# Altium schematic sheet 03_ZYNQ_Power.SchDoc
size A2; SheetNumber: 3; SheetTotal: 9
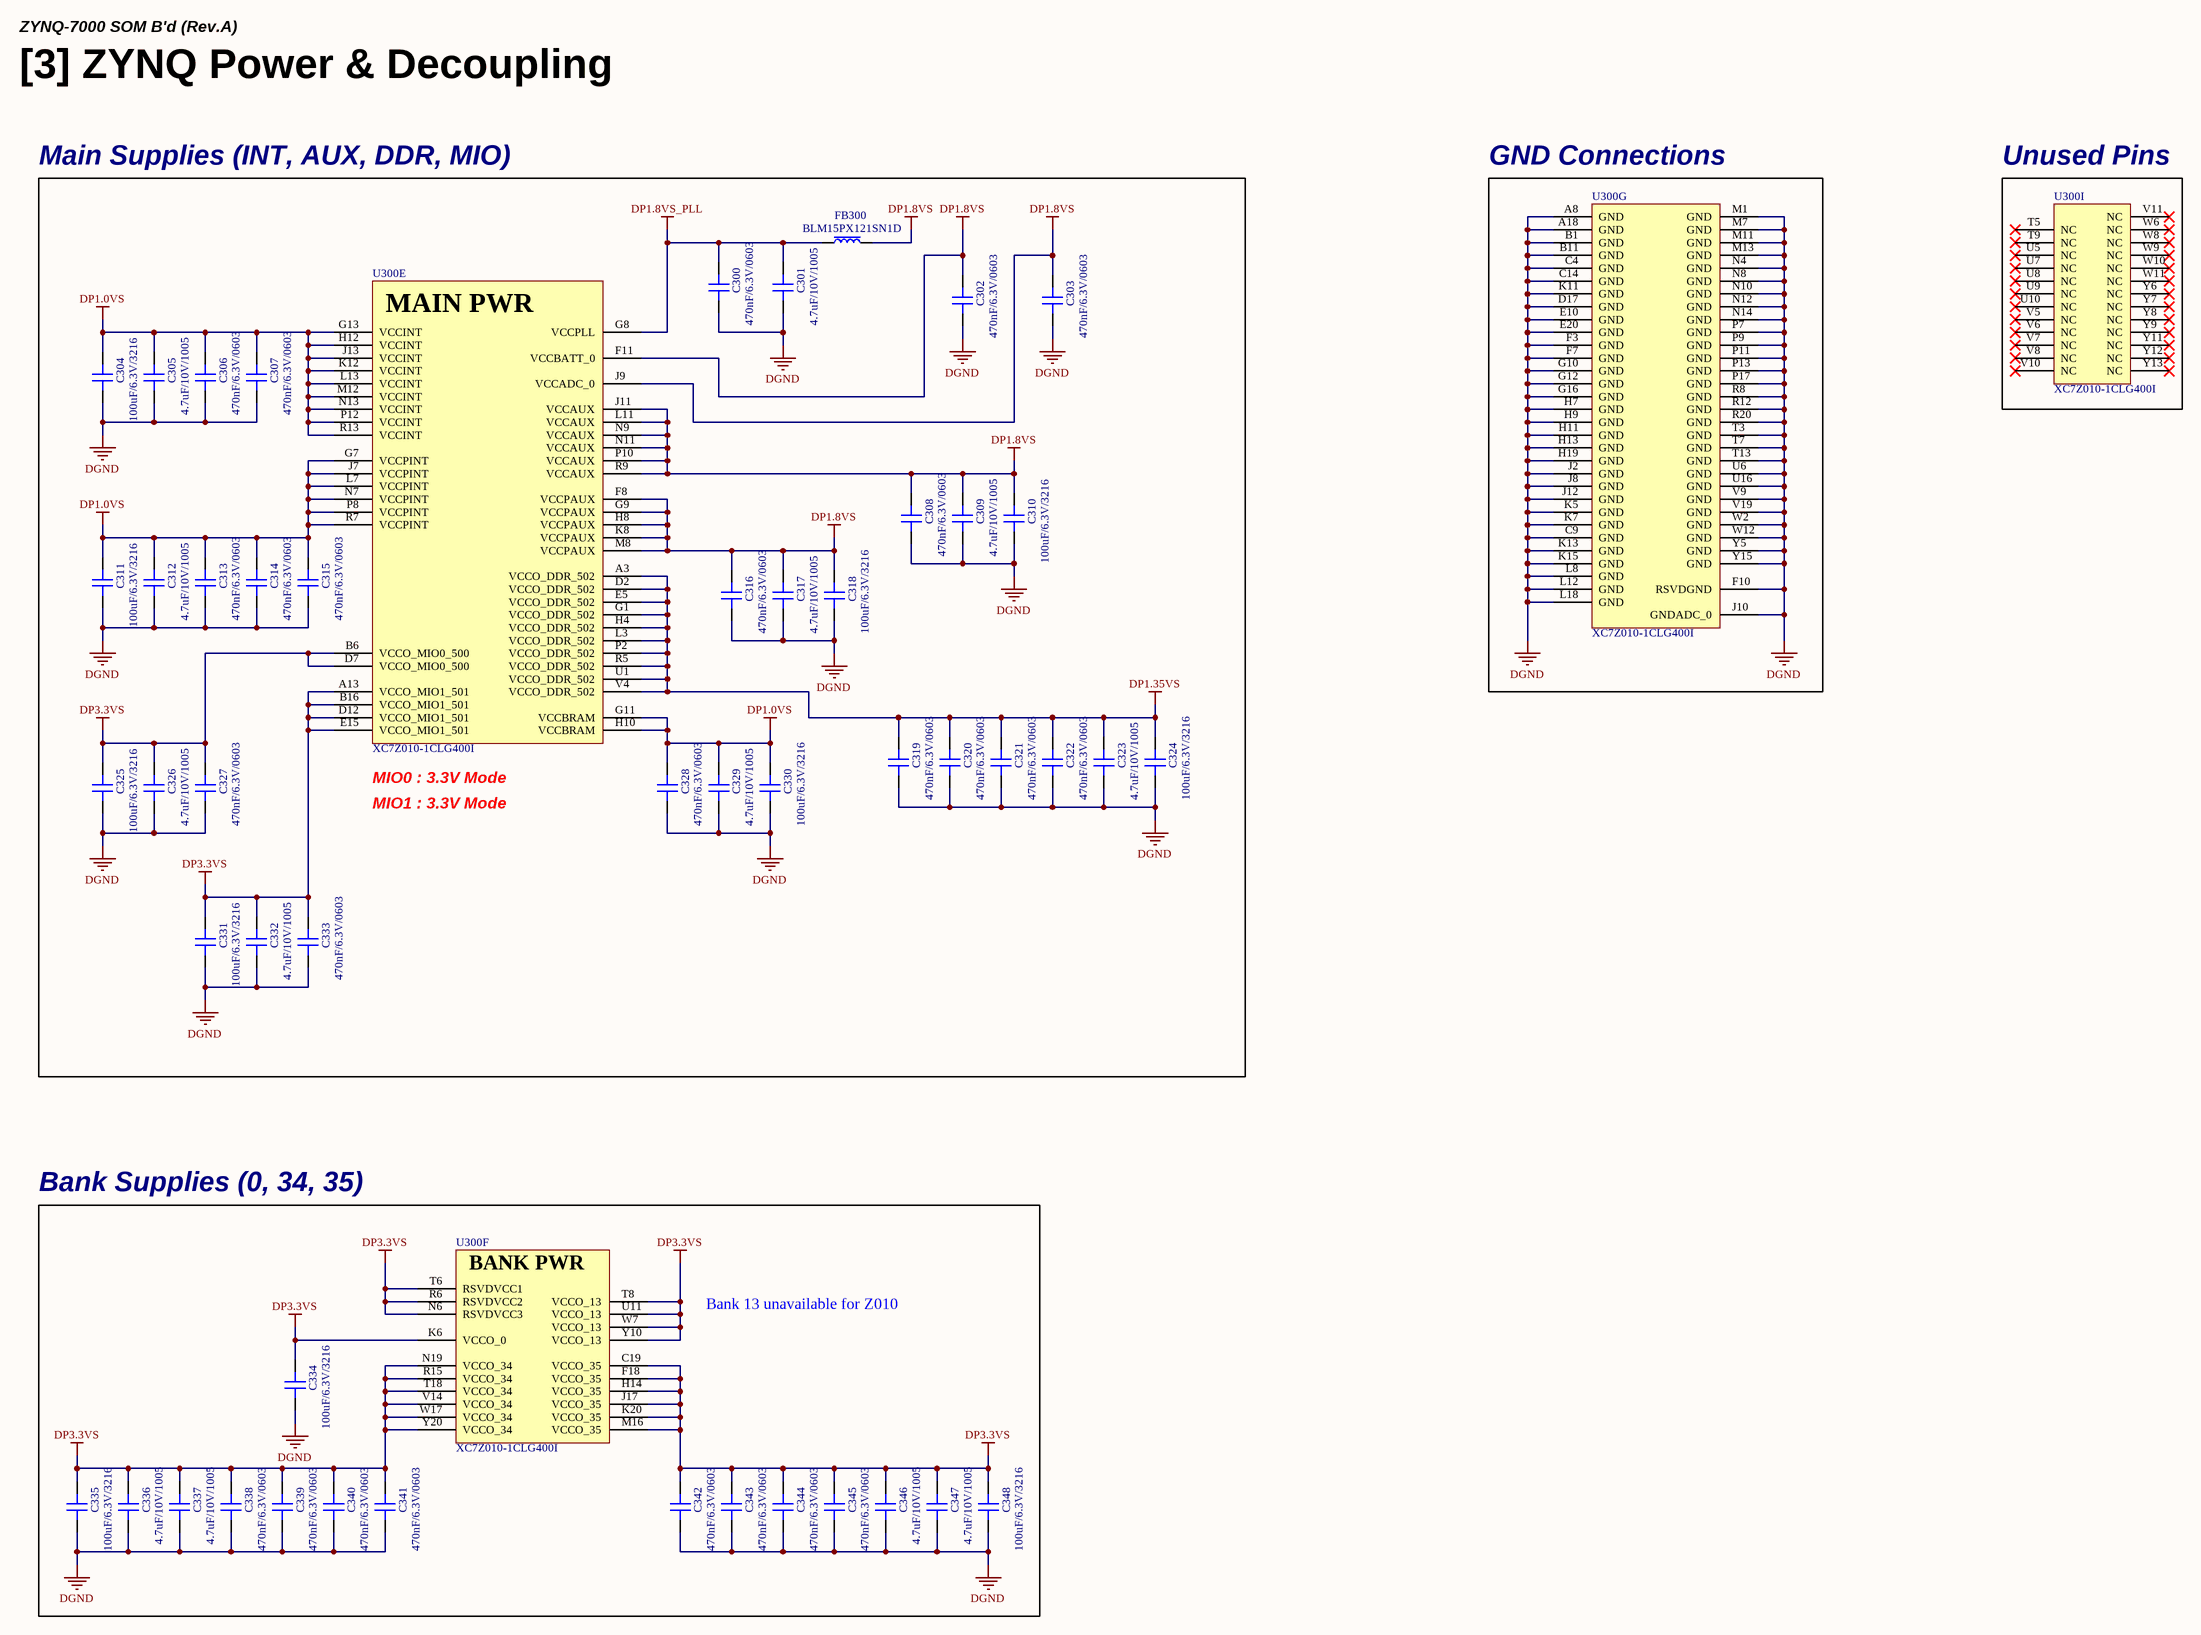
[diagram p0: 03_ZYNQ_Power.SchDoc]

## Parts
C300  470nF/6.3V/0603  [CAP 0603 (0201_INCH)]
C301  4.7uF/10V/1005  [CAP 1005 (0402_INCH)]
C302  470nF/6.3V/0603  [CAP 0603 (0201_INCH)]
C303  470nF/6.3V/0603  [CAP 0603 (0201_INCH)]
C304  100uF/6.3V/3216  [CAP 3216 (1206_INCH) - H1.8MM]
C305  4.7uF/10V/1005  [CAP 1005 (0402_INCH)]
C306  470nF/6.3V/0603  [CAP 0603 (0201_INCH)]
C307  470nF/6.3V/0603  [CAP 0603 (0201_INCH)]
C308  470nF/6.3V/0603  [CAP 0603 (0201_INCH)]
C309  4.7uF/10V/1005  [CAP 1005 (0402_INCH)]
C310  100uF/6.3V/3216  [CAP 3216 (1206_INCH) - H1.8MM]
C311  100uF/6.3V/3216  [CAP 3216 (1206_INCH) - H1.8MM]
C312  4.7uF/10V/1005  [CAP 1005 (0402_INCH)]
C313  470nF/6.3V/0603  [CAP 0603 (0201_INCH)]
C314  470nF/6.3V/0603  [CAP 0603 (0201_INCH)]
C315  470nF/6.3V/0603  [CAP 0603 (0201_INCH)]
C316  470nF/6.3V/0603  [CAP 0603 (0201_INCH)]
C317  4.7uF/10V/1005  [CAP 1005 (0402_INCH)]
C318  100uF/6.3V/3216  [CAP 3216 (1206_INCH) - H1.8MM]
C319  470nF/6.3V/0603  [CAP 0603 (0201_INCH)]
C320  470nF/6.3V/0603  [CAP 0603 (0201_INCH)]
C321  470nF/6.3V/0603  [CAP 0603 (0201_INCH)]
C322  470nF/6.3V/0603  [CAP 0603 (0201_INCH)]
C323  4.7uF/10V/1005  [CAP 1005 (0402_INCH)]
C324  100uF/6.3V/3216  [CAP 3216 (1206_INCH) - H1.8MM]
C325  100uF/6.3V/3216  [CAP 3216 (1206_INCH) - H1.8MM]
C326  4.7uF/10V/1005  [CAP 1005 (0402_INCH)]
C327  470nF/6.3V/0603  [CAP 0603 (0201_INCH)]
C328  470nF/6.3V/0603  [CAP 0603 (0201_INCH)]
C329  4.7uF/10V/1005  [CAP 1005 (0402_INCH)]
C330  100uF/6.3V/3216  [CAP 3216 (1206_INCH) - H1.8MM]
C331  100uF/6.3V/3216  [CAP 3216 (1206_INCH) - H1.8MM]
C332  4.7uF/10V/1005  [CAP 1005 (0402_INCH)]
C333  470nF/6.3V/0603  [CAP 0603 (0201_INCH)]
C334  100uF/6.3V/3216  [CAP 3216 (1206_INCH) - H1.8MM]
C335  100uF/6.3V/3216  [CAP 3216 (1206_INCH) - H1.8MM]
C336  4.7uF/10V/1005  [CAP 1005 (0402_INCH)]
C337  4.7uF/10V/1005  [CAP 1005 (0402_INCH)]
C338  470nF/6.3V/0603  [CAP 0603 (0201_INCH)]
C339  470nF/6.3V/0603  [CAP 0603 (0201_INCH)]
C340  470nF/6.3V/0603  [CAP 0603 (0201_INCH)]
C341  470nF/6.3V/0603  [CAP 0603 (0201_INCH)]
C342  470nF/6.3V/0603  [CAP 0603 (0201_INCH)]
C343  470nF/6.3V/0603  [CAP 0603 (0201_INCH)]
C344  470nF/6.3V/0603  [CAP 0603 (0201_INCH)]
C345  470nF/6.3V/0603  [CAP 0603 (0201_INCH)]
C346  4.7uF/10V/1005  [CAP 1005 (0402_INCH)]
C347  4.7uF/10V/1005  [CAP 1005 (0402_INCH)]
C348  100uF/6.3V/3216  [CAP 3216 (1206_INCH) - H1.8MM]
FB300  BLM15PX121SN1D  [FB 1005 (0402_inch)]
U300  XC7Z010-1CLG400I  [IC_SOC_XC7Z010-1CLG400I]  (parts E,F,G,I of 9)

## Blocks framed on the sheet
Main Supplies (INT, AUX, DDR, MIO): C300-C333 FB300 U300
GND Connections: U300
Unused Pins: U300
Bank Supplies (0, 34, 35): C334-C348 U300

## Nets
DGND: C300.1 C301.1 C302.1 C303.1 C304.1 C305.1 C306.1 C307.1 C308.1 C309.1 C310.1 C311.1 C312.1 C313.1 C314.1 C315.1 C316.1 C317.1 C318.1 C319.1 C320.1 C321.1 C322.1 C323.1 C324.1 C325.1 C326.1 C327.1 C328.1 C329.1 C330.1 C331.1 C332.1 C333.1 C334.1 C335.1 C336.1 C337.1 C338.1 C339.1 C340.1 C341.1 C342.1 C343.1 C344.1 C345.1 C346.1 C347.1 C348.1 U300.A8(GND) U300.A18(GND) U300.B1(GND) U300.B11(GND) U300.C4(GND) U300.C9(GND) U300.C14(GND) U300.D17(GND) U300.E10(GND) U300.E20(GND) U300.F3(GND) U300.F7(GND) U300.F10(RSVDGND) U300.G10(GND) U300.G12(GND) U300.G16(GND) U300.H7(GND) U300.H9(GND) U300.H11(GND) U300.H13(GND) U300.H19(GND) U300.J2(GND) U300.J8(GND) U300.J10(GNDADC_0) U300.J12(GND) U300.K5(GND) U300.K7(GND) U300.K11(GND) U300.K13(GND) U300.K15(GND) U300.L8(GND) U300.L12(GND) U300.L18(GND) U300.M1(GND) U300.M7(GND) U300.M11(GND) U300.M13(GND) U300.N4(GND) U300.N8(GND) U300.N10(GND) U300.N12(GND) U300.N14(GND) U300.P7(GND) U300.P9(GND) U300.P11(GND) U300.P13(GND) U300.P17(GND) U300.R8(GND) U300.R12(GND) U300.R20(GND) U300.T3(GND) U300.T7(GND) U300.T13(GND) U300.U6(GND) U300.U16(GND) U300.V9(GND) U300.V19(GND) U300.W2(GND) U300.W12(GND) U300.Y5(GND) U300.Y15(GND)
DP1.0VS: C304.2 C305.2 C306.2 C307.2 C311.2 C312.2 C313.2 C314.2 C315.2 C328.2 C329.2 C330.2 U300.G7(VCCPINT) U300.G11(VCCBRAM) U300.G13(VCCINT) U300.H10(VCCBRAM) U300.H12(VCCINT) U300.J7(VCCPINT) U300.J13(VCCINT) U300.K12(VCCINT) U300.L7(VCCPINT) U300.L13(VCCINT) U300.M12(VCCINT) U300.N7(VCCPINT) U300.N13(VCCINT) U300.P8(VCCPINT) U300.P12(VCCINT) U300.R7(VCCPINT) U300.R13(VCCINT)
DP1.8VS: C302.2 C303.2 C308.2 C309.2 C310.2 C316.2 C317.2 C318.2 FB300.2 U300.F8(VCCPAUX) U300.F11(VCCBATT_0) U300.G9(VCCPAUX) U300.H8(VCCPAUX) U300.J9(VCCADC_0) U300.J11(VCCAUX) U300.K8(VCCPAUX) U300.L11(VCCAUX) U300.M8(VCCPAUX) U300.N9(VCCAUX) U300.N11(VCCAUX) U300.P10(VCCAUX) U300.R9(VCCAUX)
DP1.8VS_PLL: C300.2 C301.2 FB300.1 U300.G8(VCCPLL)
DP1.35VS: C319.2 C320.2 C321.2 C322.2 C323.2 C324.2 U300.A3(VCCO_DDR_502) U300.D2(VCCO_DDR_502) U300.E5(VCCO_DDR_502) U300.G1(VCCO_DDR_502) U300.H4(VCCO_DDR_502) U300.L3(VCCO_DDR_502) U300.P2(VCCO_DDR_502) U300.R5(VCCO_DDR_502) U300.U1(VCCO_DDR_502) U300.V4(VCCO_DDR_502)
DP3.3VS: C325.2 C326.2 C327.2 C331.2 C332.2 C333.2 C334.2 C335.2 C336.2 C337.2 C338.2 C339.2 C340.2 C341.2 C342.2 C343.2 C344.2 C345.2 C346.2 C347.2 C348.2 U300.A13(VCCO_MIO1_501) U300.B6(VCCO_MIO0_500) U300.B16(VCCO_MIO1_501) U300.C19(VCCO_35) U300.D7(VCCO_MIO0_500) U300.D12(VCCO_MIO1_501) U300.E15(VCCO_MIO1_501) U300.F18(VCCO_35) U300.H14(VCCO_35) U300.J17(VCCO_35) U300.K6(VCCO_0) U300.K20(VCCO_35) U300.M16(VCCO_35) U300.N6(RSVDVCC3) U300.N19(VCCO_34) U300.R6(RSVDVCC2) U300.R15(VCCO_34) U300.T6(RSVDVCC1) U300.T8(VCCO_13) U300.T18(VCCO_34) U300.U11(VCCO_13) U300.V14(VCCO_34) U300.W7(VCCO_13) U300.W17(VCCO_34) U300.Y10(VCCO_13) U300.Y20(VCCO_34)

Not connected (* = marked no-connect by the designer): U300 T5(NC)* T9(NC)* U5(NC)* U7(NC)* U8(NC)* U9(NC)* U10(NC)* V5(NC)* V6(NC)* V7(NC)* V8(NC)* V10(NC)* V11(NC)* W6(NC)* W8(NC)* W9(NC)* W10(NC)* W11(NC)* Y6(NC)* Y7(NC)* Y8(NC)* Y9(NC)* Y11(NC)* Y12(NC)* Y13(NC)*

## Notes on the sheet
- ZYNQ-7000 SOM B'd (Rev.A)
- [3] ZYNQ Power & Decoupling
- (near U300) MIO0 : 3.3V Mode
- MIO1 : 3.3V Mode
- Bank 13 unavailable for Z010
- Title
- Rev
- Doc
- Sheet #
- of
- Author
- This document is copyright of ArkX and shall not be revealed, produced, copied, in whole or in part,
- Date
- nor used for any purpose other than submitted.
- (in symbol IC_SOC_XC7Z010-1CLG400I, part E) MAIN PWR
- (in symbol IC_SOC_XC7Z010-1CLG400I, part F) BANK PWR

## Library data of the parts
C300 C302 C303 C306-C308 C313-C316 C319-C322 C327 C328 C333 C338-C345 = CAP_470nF/6.3V/0603: 6.3V 470nF X5R ±10% 0201  Multilayer Ceramic Capacitors MLCC - SMD/SMT ROHS; LCSC Part #: C85926; JLCPCB Part Type: Extended Part
C301 C305 C309 C312 C317 C323 C326 C329 C332 C336 C337 C346 C347 = CAP_4.7uF/10V/1005: 10V 4.7uF X5R ±20% 0402  Multilayer Ceramic Capacitors MLCC - SMD/SMT ROHS; JLCPCB Part Type: Basic Part; LCSC Part #: C23733
C304 C310 C311 C318 C324 C325 C330 C331 C334 C335 C348 = CAP_100uF/6.3V/3216: Ceramic CAP_100uF/6.3V/3216; LCSC Part #: C15008; JLCPCB Part Type: Basic Part
FB300 = FB_BLM15PX121SN1D: 55mΩ ±25% 120Ω@100MHz 0402  Ferrite Beads ROHS; LCSC Part #: C88970; JLCPCB Part Type: Extended Part
U300 = IC_SOC_XC7Z010-1CLG400I: Dual ARM® Cortex®-A9 MPCore™ with CoreSight™ System On Chip (SOC) IC Zynq®-7000 Artix™-7 FPGA, 28K Logic Cells 766MHz 400-CSPBGA (17x17); LCSC Part #: C2840994; JLCPCB Part Type: Extended Part